# Altium schematic sheet Sheet1.SchDoc
size A; SheetNumber: 1; SheetTotal: 2
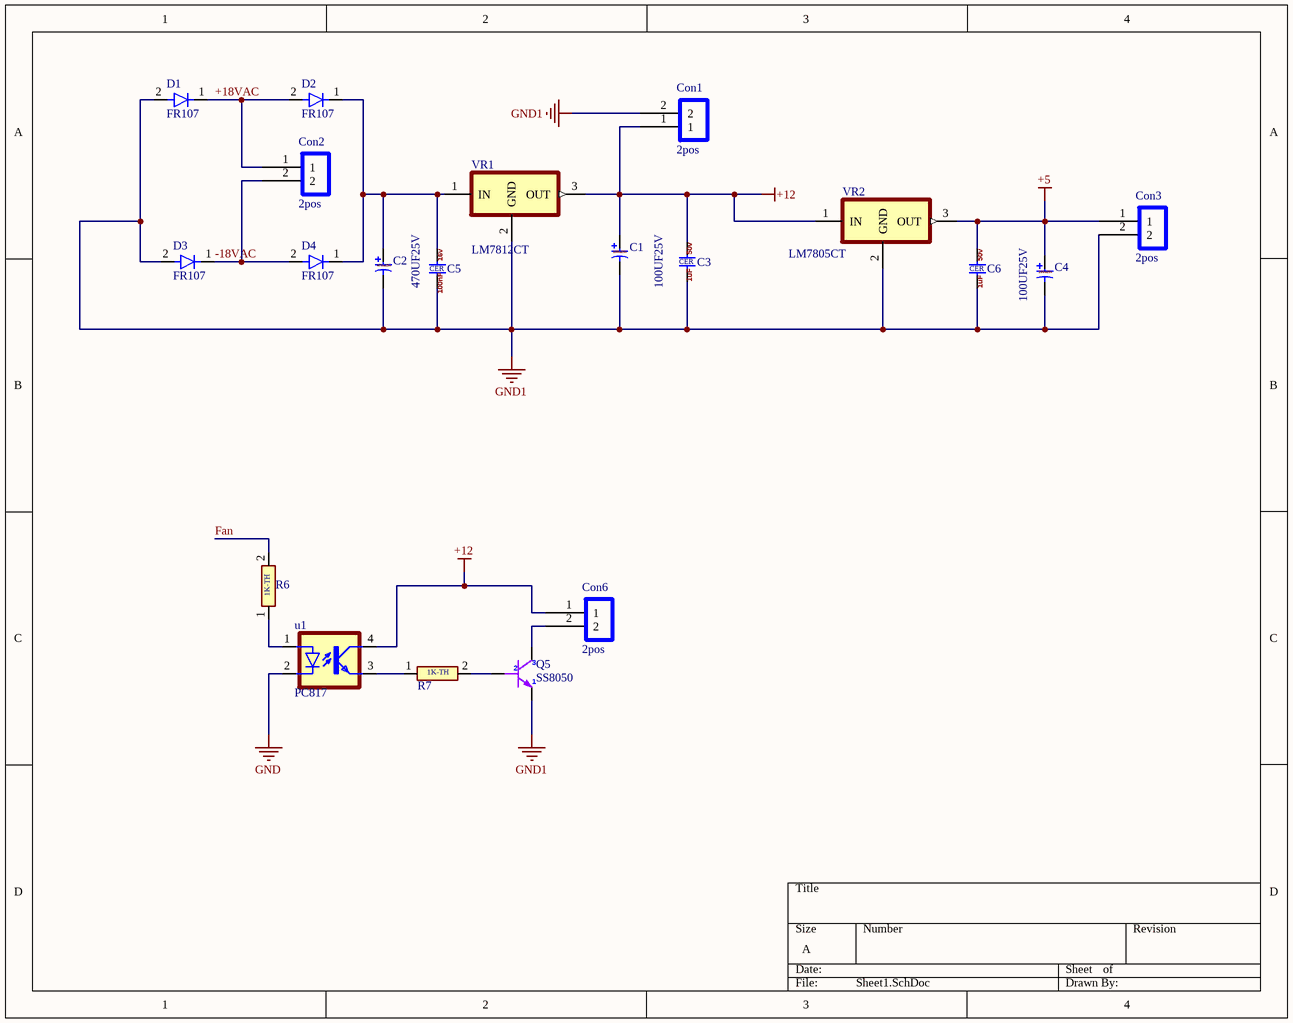
[diagram p0: Sheet1.SchDoc]

## Parts
C1  100UF25V  [CAP LS-2.5mm D6.3 H7 - duplicate]
C2  470UF25V  [CAP_RADIAL_D13.0_P5.0_H20.0]
C3  1UFCER  [CAP-CER-2.54]  (value not drawn)
C4  100UF25V  [CAP LS-2.5mm D6.3 H7 - duplicate]
C5  100nFCER  [CAP-CER-2.54]  (value not drawn)
C6  1UFCER  [CAP-CER-2.54]  (value not drawn)
Con1  2pos  [2POS]
Con2  2pos  [2POS]
Con3  2pos  [2POS]
Con6  2pos  [2pos]
D1  FR107  [DIOAD1036W78L470D235]
D2  FR107  [DIOAD1036W78L470D235]
D3  FR107  [DIOAD1036W78L470D235]
D4  FR107  [DIOAD1036W78L470D235]
Q5  SS8050  [TO-92]
R6  1K  [RES-TH-7mm]  (value not drawn)
R7  1K  [RES-TH-7mm]  (value not drawn)
u1  PC817  [DIP-4]
VR1  LM7812CT  [TO254P1054X470X1955-3]
VR2  LM7805CT  [TO254P1054X470X1955-3]

## Nets
+5: C4.1 C6.2 Con3.1 VR2.3(OUT)
+12: C1.1 C3.2 Con1.1 Con6.1 u1.4(COL) VR1.3(OUT) VR2.1(IN)
GND: u1.2(C)
GND1: C1.2 C2.2 C3.1 C4.2 C5.1 C6.1 Con1.2 Con3.2 D1.2 D3.2 Q5.1(E) VR1.2(GND) VR2.2(GND)
+18VAC: Con2.1 D1.1 D2.2
-18VAC: Con2.2 D3.1 D4.2
Fan: R6.2
NetC2_1: C2.1 C5.2 D2.1 D4.1 VR1.1(IN)
NetCon6_2: Con6.2 Q5.3(C)
NetQ5_2: Q5.2(B) R7.2
NetR6_1: R6.1 u1.1(A)
NetR7_1: R7.1 u1.3(EMIT)

## Notes on the sheet
- (in symbol 1K) 1K-TH
- (in symbol 1UFCER) 50v; CER; 1uF
- (in symbol 100nFCER) 16v; CER; 100nF
- (in symbol 100UF25V) 100u25v
- (in symbol 470UF25V) 470u25v

## Library data of the parts
C1 C4 = 100UF25V: CAP TH AL: 100U 25V; LCSC Part #: C43351; Unit Price: 0.0057
C2 = 470UF25V: CAP TH AL: 470U 25V; LCSC Part #: C43351; Unit Price: 0.0057
C3 C6 = 1UFCER: CAP: CER 1UF 50V; LCSC Part #: C1848; Unit Price: 0.0104
C5 = 100nFCER: CAP: CER 100nF 16V; LCSC Part #: C1848; Unit Price: 0.0104
Con1-Con3 Con6 = 2pos: P2.54mm
D1-D4 = FR107: DIODE: GEN 1A 1.0V@1A 1kV DO-41 TH; LCSC Part #: C36138; Unit Price: 0.0313
Q5 = SS8050: Transistor: 25V 300mW 120@100mA,1V 1.5A NPN SOT-23; LCSC Part #: C59205; Unit Price: 0.0048
R6 R7 = 1K: RES TH: 1K
u1 = PC817: Optoisolator Transistor Output 5000Vrms 1 Channel 4-DIP
VR1 = LM7812CT: 1.5-A, 12-V, linear voltage regulator; MF: Texas Instruments; MP: LM7812CT/NOPB; SnapEDA_Link: https://www.snapeda.com/parts/LM7812CT/NOPB/Texas+Instruments/view-part/?ref=snap; Package: TO-220-3 Texas Instruments; Value: *; Check_prices: https://www.snapeda.com/parts/LM7812CT/NOPB/Texas+Instruments/view-part/?ref=eda
VR2 = LM7805CT: 1.5-A,  5-V, linear voltage regulator; MF: Texas Instruments; MP: LM7812CT/NOPB; SnapEDA_Link: https://www.snapeda.com/parts/LM7812CT/NOPB/Texas+Instruments/view-part/?ref=snap; Package: TO-220-3 Texas Instruments; Value: *; Check_prices: https://www.snapeda.com/parts/LM7812CT/NOPB/Texas+Instruments/view-part/?ref=eda